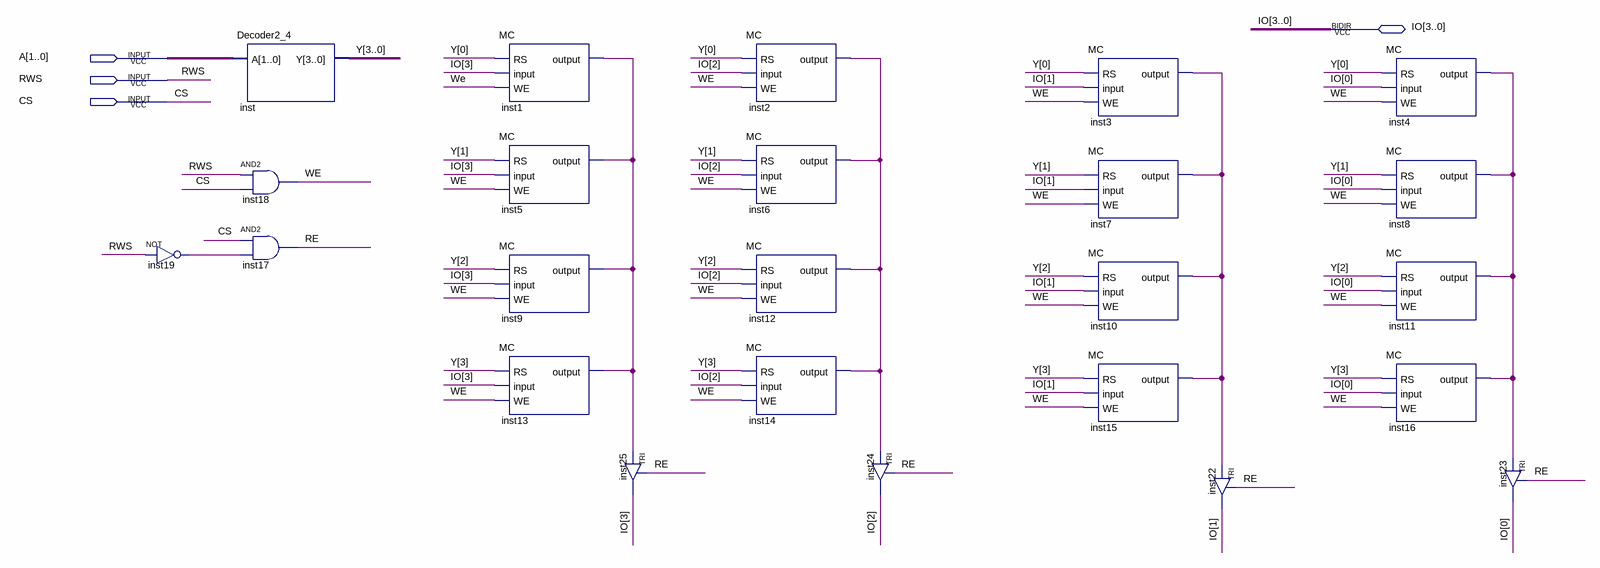
[diagram p0: schematic sheet]
// Quartus schematic RAM4_4.bdf as structural Verilog: 24 symbols, 4 pins
module RAM4_4 (
  input  [1:0] A,
  input  RWS,
  input  CS,
  inout  [3:0] IO
);

  wire inst1_output, inst2_output, inst3_output, inst4_output, inst19_out, RE, We;
  wire [3:0] Y;

  not inst19 (inst19_out, RWS);
  Decoder2_4 inst (.A(A), .Y(Y));
  and inst18 (We, RWS, CS);
  and inst17 (RE, CS, inst19_out);
  MC inst1 (.RS(Y[0]), .\input (IO[3]), .WE(We), .\output (inst1_output));
  MC inst5 (.RS(Y[1]), .\input (IO[3]), .WE(We), .\output (inst1_output));
  MC inst9 (.RS(Y[2]), .\input (IO[3]), .WE(We), .\output (inst1_output));
  MC inst13 (.RS(Y[3]), .\input (IO[3]), .WE(We), .\output (inst1_output));
  TRI inst25 (.IN(inst1_output), .OE(RE), .OUT(IO[3]));
  MC inst2 (.RS(Y[0]), .\input (IO[2]), .WE(We), .\output (inst2_output));
  MC inst6 (.RS(Y[1]), .\input (IO[2]), .WE(We), .\output (inst2_output));
  MC inst12 (.RS(Y[2]), .\input (IO[2]), .WE(We), .\output (inst2_output));
  MC inst14 (.RS(Y[3]), .\input (IO[2]), .WE(We), .\output (inst2_output));
  TRI inst24 (.IN(inst2_output), .OE(RE), .OUT(IO[2]));
  MC inst3 (.RS(Y[0]), .\input (IO[1]), .WE(We), .\output (inst3_output));
  MC inst7 (.RS(Y[1]), .\input (IO[1]), .WE(We), .\output (inst3_output));
  MC inst10 (.RS(Y[2]), .\input (IO[1]), .WE(We), .\output (inst3_output));
  MC inst15 (.RS(Y[3]), .\input (IO[1]), .WE(We), .\output (inst3_output));
  TRI inst22 (.IN(inst3_output), .OE(RE), .OUT(IO[1]));
  MC inst4 (.RS(Y[0]), .\input (IO[0]), .WE(We), .\output (inst4_output));
  MC inst8 (.RS(Y[1]), .\input (IO[0]), .WE(We), .\output (inst4_output));
  MC inst11 (.RS(Y[2]), .\input (IO[0]), .WE(We), .\output (inst4_output));
  MC inst16 (.RS(Y[3]), .\input (IO[0]), .WE(We), .\output (inst4_output));
  TRI inst23 (.IN(inst4_output), .OE(RE), .OUT(IO[0]));
endmodule
